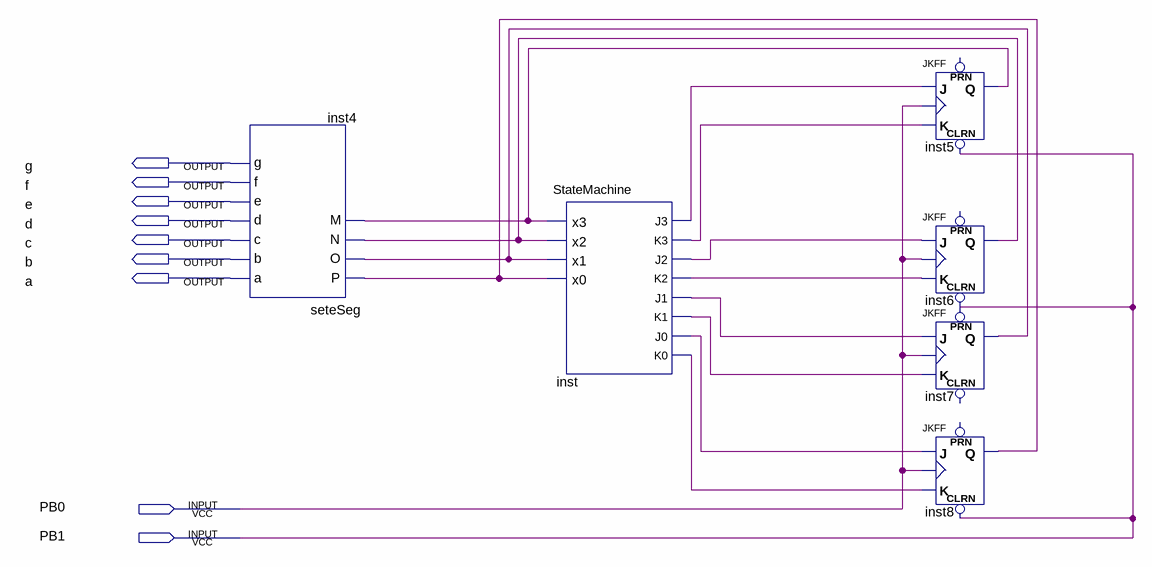
[diagram p0: schematic sheet]
// Quartus schematic lab5.bdf as structural Verilog: 6 symbols, 9 pins
module lab5 (
  input  PB0,
  input  PB1,
  output g,
  output f,
  output e,
  output d,
  output c,
  output b,
  output a
);

  wire inst5_q, inst6_q, inst7_q, inst8_q, inst_j0, inst_j1, inst_j2, inst_j3, inst_k0, inst_k1, inst_k2,
       inst_k3;

  seteSeg inst4 (.M(inst5_q), .N(inst6_q), .O(inst7_q), .P(inst8_q), .a(a), .b(b), .c(c), .d(d), .e(e), .f(f), .g(g));
  StateMachine inst (
    .x3(inst5_q), .x2(inst6_q), .x1(inst7_q), .x0(inst8_q), .J3(inst_j3), .K3(inst_k3), .J2(inst_j2),
    .K2(inst_k2), .J1(inst_j1), .K1(inst_k1), .J0(inst_j0), .K0(inst_k0));
  JKFF inst5 (.CLRN(PB1), .K(inst_k3), .J(inst_j3), .CLK(PB0), .Q(inst5_q));  // open: PRN
  JKFF inst6 (.CLRN(PB1), .K(inst_k2), .J(inst_j2), .CLK(PB0), .Q(inst6_q));  // open: PRN
  JKFF inst7 (.PRN(PB1), .K(inst_k1), .J(inst_j1), .CLK(PB0), .Q(inst7_q));  // open: CLRN
  JKFF inst8 (.CLRN(PB1), .K(inst_k0), .J(inst_j0), .CLK(PB0), .Q(inst8_q));  // open: PRN
endmodule
